# EAGLE schematic Pullup_resistors (EAGLE 9.6.2)
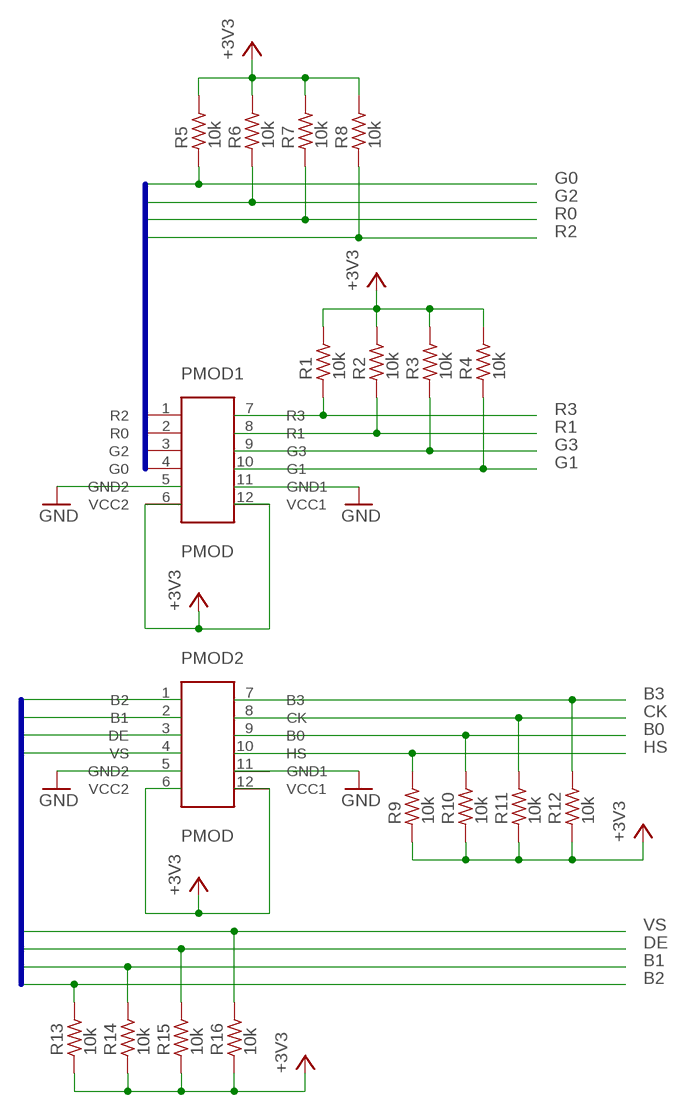
[diagram p0: schematic, sheet 1]

## Parts
PMOD1  PMOD  [MA06-2]
PMOD2  PMOD  [MA06-2]
R1  10k  RC-MASTER-SMD_R_0603MP  [RC-MASTER-SMD_R0603MP]
R2  10k  RC-MASTER-SMD_R_0603MP  [RC-MASTER-SMD_R0603MP]
R3  10k  RC-MASTER-SMD_R_0603MP  [RC-MASTER-SMD_R0603MP]
R4  10k  RC-MASTER-SMD_R_0603MP  [RC-MASTER-SMD_R0603MP]
R5  10k  RC-MASTER-SMD_R_0603MP  [RC-MASTER-SMD_R0603MP]
R6  10k  RC-MASTER-SMD_R_0603MP  [RC-MASTER-SMD_R0603MP]
R7  10k  RC-MASTER-SMD_R_0603MP  [RC-MASTER-SMD_R0603MP]
R8  10k  RC-MASTER-SMD_R_0603MP  [RC-MASTER-SMD_R0603MP]
R9  10k  RC-MASTER-SMD_R_0603MP  [RC-MASTER-SMD_R0603MP]
R10  10k  RC-MASTER-SMD_R_0603MP  [RC-MASTER-SMD_R0603MP]
R11  10k  RC-MASTER-SMD_R_0603MP  [RC-MASTER-SMD_R0603MP]
R12  10k  RC-MASTER-SMD_R_0603MP  [RC-MASTER-SMD_R0603MP]
R13  10k  RC-MASTER-SMD_R_0603MP  [RC-MASTER-SMD_R0603MP]
R14  10k  RC-MASTER-SMD_R_0603MP  [RC-MASTER-SMD_R0603MP]
R15  10k  RC-MASTER-SMD_R_0603MP  [RC-MASTER-SMD_R0603MP]
R16  10k  RC-MASTER-SMD_R_0603MP  [RC-MASTER-SMD_R0603MP]

## Nets
B0: PMOD2.9(B0) R10.2
B1: R14.2
B2: R13.2
B3: PMOD2.7(B3) R12.2
CK: PMOD2.8(CK) R11.2
DE: R15.2
G0: R5.1
G1: PMOD1.10(G1) R4.1
G2: R6.1
G3: PMOD1.9(G3) R3.1
GND: PMOD1.5(GND2) PMOD1.11(GND1) PMOD2.5(GND2) PMOD2.11(GND1)
HS: PMOD2.10(HS) R9.2
N$17: PMOD2.4(VS)
N$18: PMOD2.3(DE)
N$19: PMOD2.2(B1)
N$20: PMOD2.1(B2)
R0: R7.1
R1: PMOD1.8(R1) R2.1
R2: R8.1
R3: PMOD1.7(R3) R1.1
VCC: PMOD1.6(VCC2) PMOD1.12(VCC1) PMOD2.6(VCC2) PMOD2.12(VCC1) R1.2 R2.2 R3.2 R4.2 R5.2 R6.2 R7.2 R8.2 R9.1 R10.1 R11.1 R12.1 R13.1 R14.1 R15.1 R16.1 ; supply symbol labelled +3V3
VS: R16.2
Unconnected: PMOD1.1(R2) PMOD1.2(R0) PMOD1.3(G2) PMOD1.4(G0)

## Buses
B$1
B$2

## Library data of the parts
PMOD1 = PMOD:PMOD
PMOD2 = PMOD 2:PMOD
R1-R16 = 52101-101-REV-A_v16:RC-MASTER-SMD_R_: RESISTOR